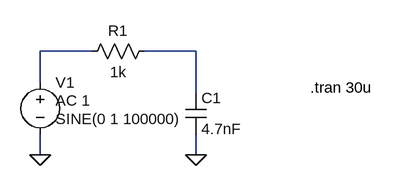
[diagram p0: schematic lpf-tran.asc]
lpf-tran.asc, the LTspice schematic file:
Version 4
SHEET 1 880 680
WIRE 112 96 32 96
WIRE 272 96 192 96
WIRE 32 144 32 96
WIRE 272 160 272 96
WIRE 32 256 32 224
WIRE 272 256 272 224
FLAG 32 256 0
FLAG 272 256 0
SYMBOL res 208 80 R90
WINDOW 0 0 56 VBottom 2
WINDOW 3 32 56 VTop 2
SYMATTR InstName R1
SYMATTR Value 1k
SYMBOL cap 256 160 R0
SYMATTR InstName C1
SYMATTR Value 4.7nF
SYMBOL voltage 32 128 R0
WINDOW 123 24 44 Left 2
WINDOW 39 0 0 Left 0
WINDOW 3 24 72 Left 2
SYMATTR Value2 AC 1
SYMATTR InstName V1
SYMATTR Value SINE(0 1 100000)
TEXT 448 152 Left 2 !.tran 30u

The netlist it stands for:
* lpf-tran.asc
R1 N002 N001 1k
C1 N002 0 4.7nF
V1 N001 0 SINE(0 1 100000) AC 1
.tran 30u
.backanno
.end